# Altium schematic sheet Motor_External_Connectors.SchDoc
size B
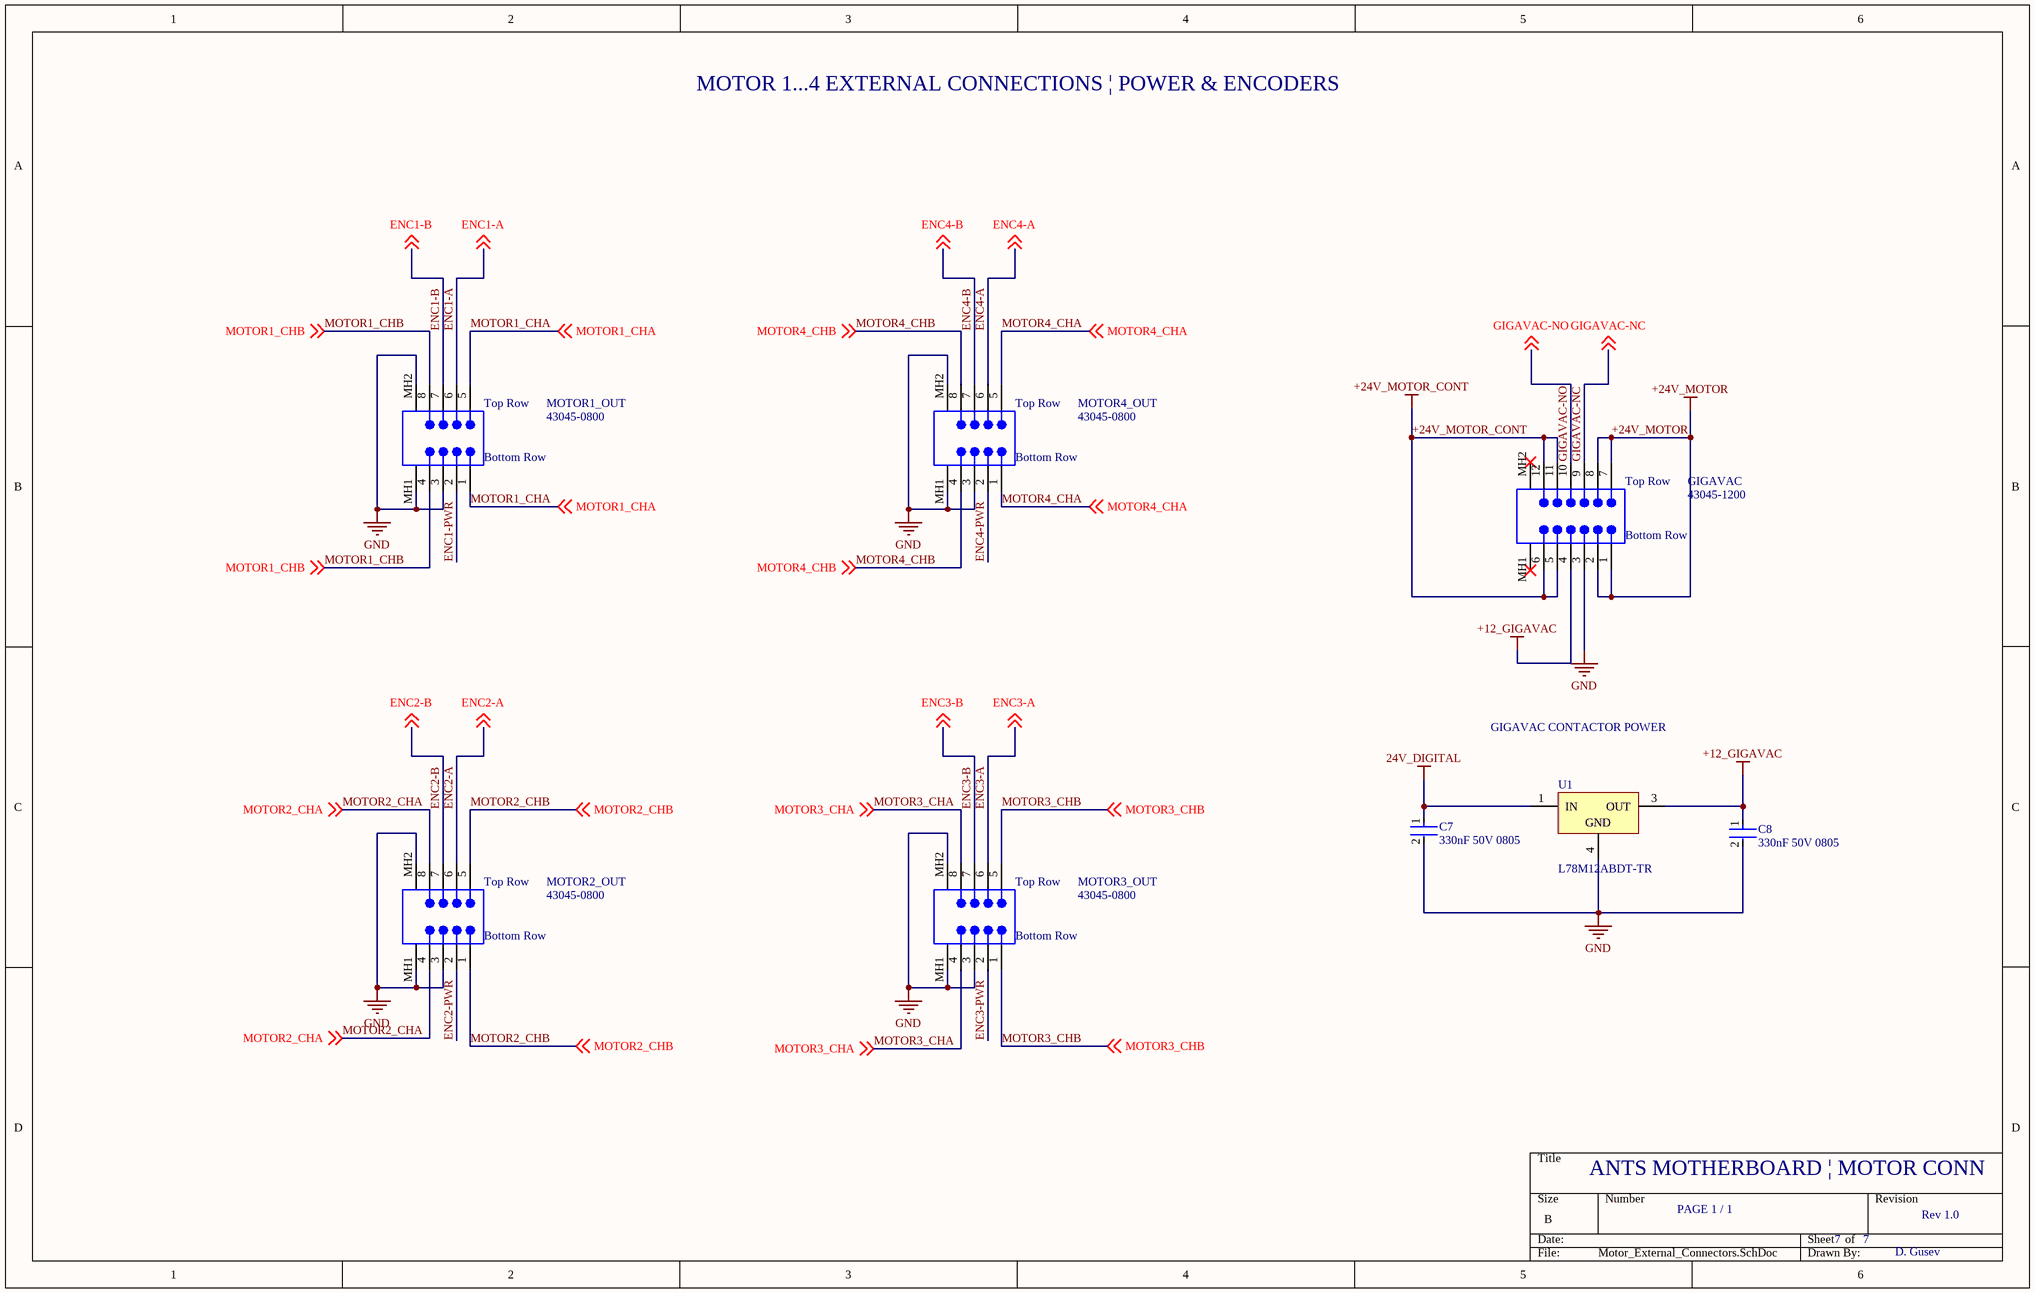
[diagram p0: Motor_External_Connectors.SchDoc]

## Parts
C7  330nF 50V 0805  [FP-C0805C-DN-MFG]
C8  330nF 50V 0805  [FP-C0805C-DN-MFG]
GIGAVAC  43045-1200  [MOLX-43045-1200]
MOTOR1_OUT  43045-0800  [MOLX-43045-0800]
MOTOR2_OUT  43045-0800  [MOLX-43045-0800]
MOTOR3_OUT  43045-0800  [MOLX-43045-0800]
MOTOR4_OUT  43045-0800  [MOLX-43045-0800]
U1  L78M12ABDT-TR  [TO-252_M]

## Nets
24V_DIGITAL: C7.1 U1.1(IN)
+12_GIGAVAC: C8.1 GIGAVAC.4 U1.3(OUT)
+24V_MOTOR: GIGAVAC.1 GIGAVAC.2 GIGAVAC.7 GIGAVAC.8
+24V_MOTOR_CONT: GIGAVAC.5 GIGAVAC.6 GIGAVAC.11 GIGAVAC.12
GND: C7.2 C8.2 GIGAVAC.3 MOTOR1_OUT.3 MOTOR1_OUT.MH1 MOTOR1_OUT.MH2 MOTOR2_OUT.3 MOTOR2_OUT.MH1 MOTOR2_OUT.MH2 MOTOR3_OUT.3 MOTOR3_OUT.MH1 MOTOR3_OUT.MH2 MOTOR4_OUT.3 MOTOR4_OUT.MH1 MOTOR4_OUT.MH2 U1.4(GND)
ENC1-A: MOTOR1_OUT.6 ; off-sheet ENC1-A
ENC1-B: MOTOR1_OUT.7 ; off-sheet ENC1-B
ENC1-PWR: MOTOR1_OUT.2
ENC2-A: MOTOR2_OUT.6 ; off-sheet ENC2-A
ENC2-B: MOTOR2_OUT.7 ; off-sheet ENC2-B
ENC2-PWR: MOTOR2_OUT.2
ENC3-A: MOTOR3_OUT.6 ; off-sheet ENC3-A
ENC3-B: MOTOR3_OUT.7 ; off-sheet ENC3-B
ENC3-PWR: MOTOR3_OUT.2
ENC4-A: MOTOR4_OUT.6 ; off-sheet ENC4-A
ENC4-B: MOTOR4_OUT.7 ; off-sheet ENC4-B
ENC4-PWR: MOTOR4_OUT.2
GIGAVAC-NC: GIGAVAC.9 ; off-sheet GIGAVAC-NC
GIGAVAC-NO: GIGAVAC.10 ; off-sheet GIGAVAC-NO
MOTOR1_CHA: MOTOR1_OUT.1 MOTOR1_OUT.5 ; off-sheet MOTOR1_CHA
MOTOR1_CHB: MOTOR1_OUT.4 MOTOR1_OUT.8 ; off-sheet MOTOR1_CHB
MOTOR2_CHA: MOTOR2_OUT.4 MOTOR2_OUT.8 ; off-sheet MOTOR2_CHA
MOTOR2_CHB: MOTOR2_OUT.1 MOTOR2_OUT.5 ; off-sheet MOTOR2_CHB
MOTOR3_CHA: MOTOR3_OUT.4 MOTOR3_OUT.8 ; off-sheet MOTOR3_CHA
MOTOR3_CHB: MOTOR3_OUT.1 MOTOR3_OUT.5 ; off-sheet MOTOR3_CHB
MOTOR4_CHA: MOTOR4_OUT.1 MOTOR4_OUT.5 ; off-sheet MOTOR4_CHA
MOTOR4_CHB: MOTOR4_OUT.4 MOTOR4_OUT.8 ; off-sheet MOTOR4_CHB

Not connected (* = marked no-connect by the designer): GIGAVAC MH1* MH2*

## Notes on the sheet
- MOTOR 1...4 EXTERNAL CONNECTIONS | POWER & ENCODERS
- GIGAVAC CONTACTOR POWER
- ANTS MOTHERBOARD | MOTOR CONN
- PAGE 1 / 1
- 7
- Rev 1.0
- D. Gusev
- (in symbol Molex 0430450-800) Top Row; Bottom Row
- (in symbol Molex 0430451-200) Top Row; Bottom Row

## Library data of the parts
C7 C8 = CMP-1036-04607-3: CAP CER 0.33UF 50V X7R 0805; Manufacturer Part Number: C0805C334K5RACTU; Manufacturer: KEMET; Temperature Coefficient: 30ppm/°C; Value: 0.33 μF; Material: Ceramic; Tolerance: 0.1; Temperature: -55°C to +125°C; Temperature Range Low: -55°C; Voltage Rating: 50 V; Lead Free: Yes; Mouser Description: Multilayer Ceramic Capacitors MLCC - SMD/SMT 50volts 0.33uF 10% X7R; Automotive: No; Package: C0805C-DN; Temperature Characteristic: X7R; Capacitance: 0.33 μF; Digikey Description: CAP CER 0.33UF 50V X7R 0805; Device Class L3: Ceramic Capacitors; Temperature Range High: +125°C; Category: Cap; Ipc Land Pattern Name: CAPC200125X78; ComponentLink2URL: https://content.kemet.com/datasheets/KEM_C1003_C0G_SMD.pdf; ComponentLink2Description: Datasheet; RoHS: TRUE; Device Class L1: Passive Components; Height: 0.88mm; Octopart: https://octopart.com/c0805c334k5ractu-kemet-10475704; Device Class L2: Capacitors
GIGAVAC = Molex 0430451-200: 3 mm Pitch Micro-Fit 3.0 Connector, 17.27 mm Mated Height, Vertical, Through Hole, 12 Circuits, -40 to 105 degC, RoHS, Tray; PartNumber: 43045-0812; Pitch: 3 mm; No. of Positions: 8; No. of Rows: 2; ComponentLink2Description: Datasheet; ComponentLink2URL: http://www.molex.com/webdocs/datasheets/pdf/en-us/0430450812_PCB_HEADERS.pdf; Orientation: Vertical; Packing: Tray; Temperature Min: -40 degC; RoHS: TRUE; ComponentLink3Description: Package Specification; Temperature Max: 105 degC; ComponentLink3URL: http://www.molex.com/pdm_docs/sd/430450812_sd.pdf; Mounting Technology: Through Hole; PackageVersion: Rev. F, 06/2009; ComponentLink1Description: Manufacturer URL; PackageDescription: 8-Pin PCB Header, Vertical, Pitch 3 mm, Mated Height 17.27 mm, Through Hole; ComponentLink1URL: http://www.molex.com/
MOTOR1_OUT MOTOR2_OUT MOTOR3_OUT MOTOR4_OUT = Molex 0430450-800: 3 mm Pitch Micro-Fit 3.0 Connector, 17.27 mm Mated Height, Vertical, Through Hole, 8 Circuits, -40 to 105 degC, RoHS, Tray; PartNumber: 43045-0812; Pitch: 3 mm; No. of Positions: 8; No. of Rows: 2; ComponentLink2Description: Datasheet; ComponentLink2URL: http://www.molex.com/webdocs/datasheets/pdf/en-us/0430450812_PCB_HEADERS.pdf; Orientation: Vertical; Packing: Tray; Temperature Min: -40 degC; RoHS: TRUE; ComponentLink3Description: Package Specification; Temperature Max: 105 degC; ComponentLink3URL: http://www.molex.com/pdm_docs/sd/430450812_sd.pdf; Mounting Technology: Through Hole; PackageVersion: Rev. F, 06/2009; ComponentLink1Description: Manufacturer URL; PackageDescription: 8-Pin PCB Header, Vertical, Pitch 3 mm, Mated Height 17.27 mm, Through Hole; ComponentLink1URL: http://www.molex.com/
U1 = CMP-0244-00186-1: Precision 500mA Regulator, 12V, 3-Pin DPAK, Tape and Reel; ComponentLink2Description: Datasheet; PackageDescription: 3-Pin Transistor Outline Package 2.28 mm Pitch, 9.7 mm Lead Span (DPAK); PackageVersion: 2011; ComponentLink2URL: http://www.st.com/internet/com/TECHNICAL_RESOURCES/TECHNICAL_LITERATURE/DATASHEET/CD00000448.pdf; ComponentLink1URL: http://www.st.com; PackageReference: TO-252; DatasheetVersion: 1/11/2010; ComponentLink1Description: Manufacturer URL